# Altium project G2_LV.PrjPcb
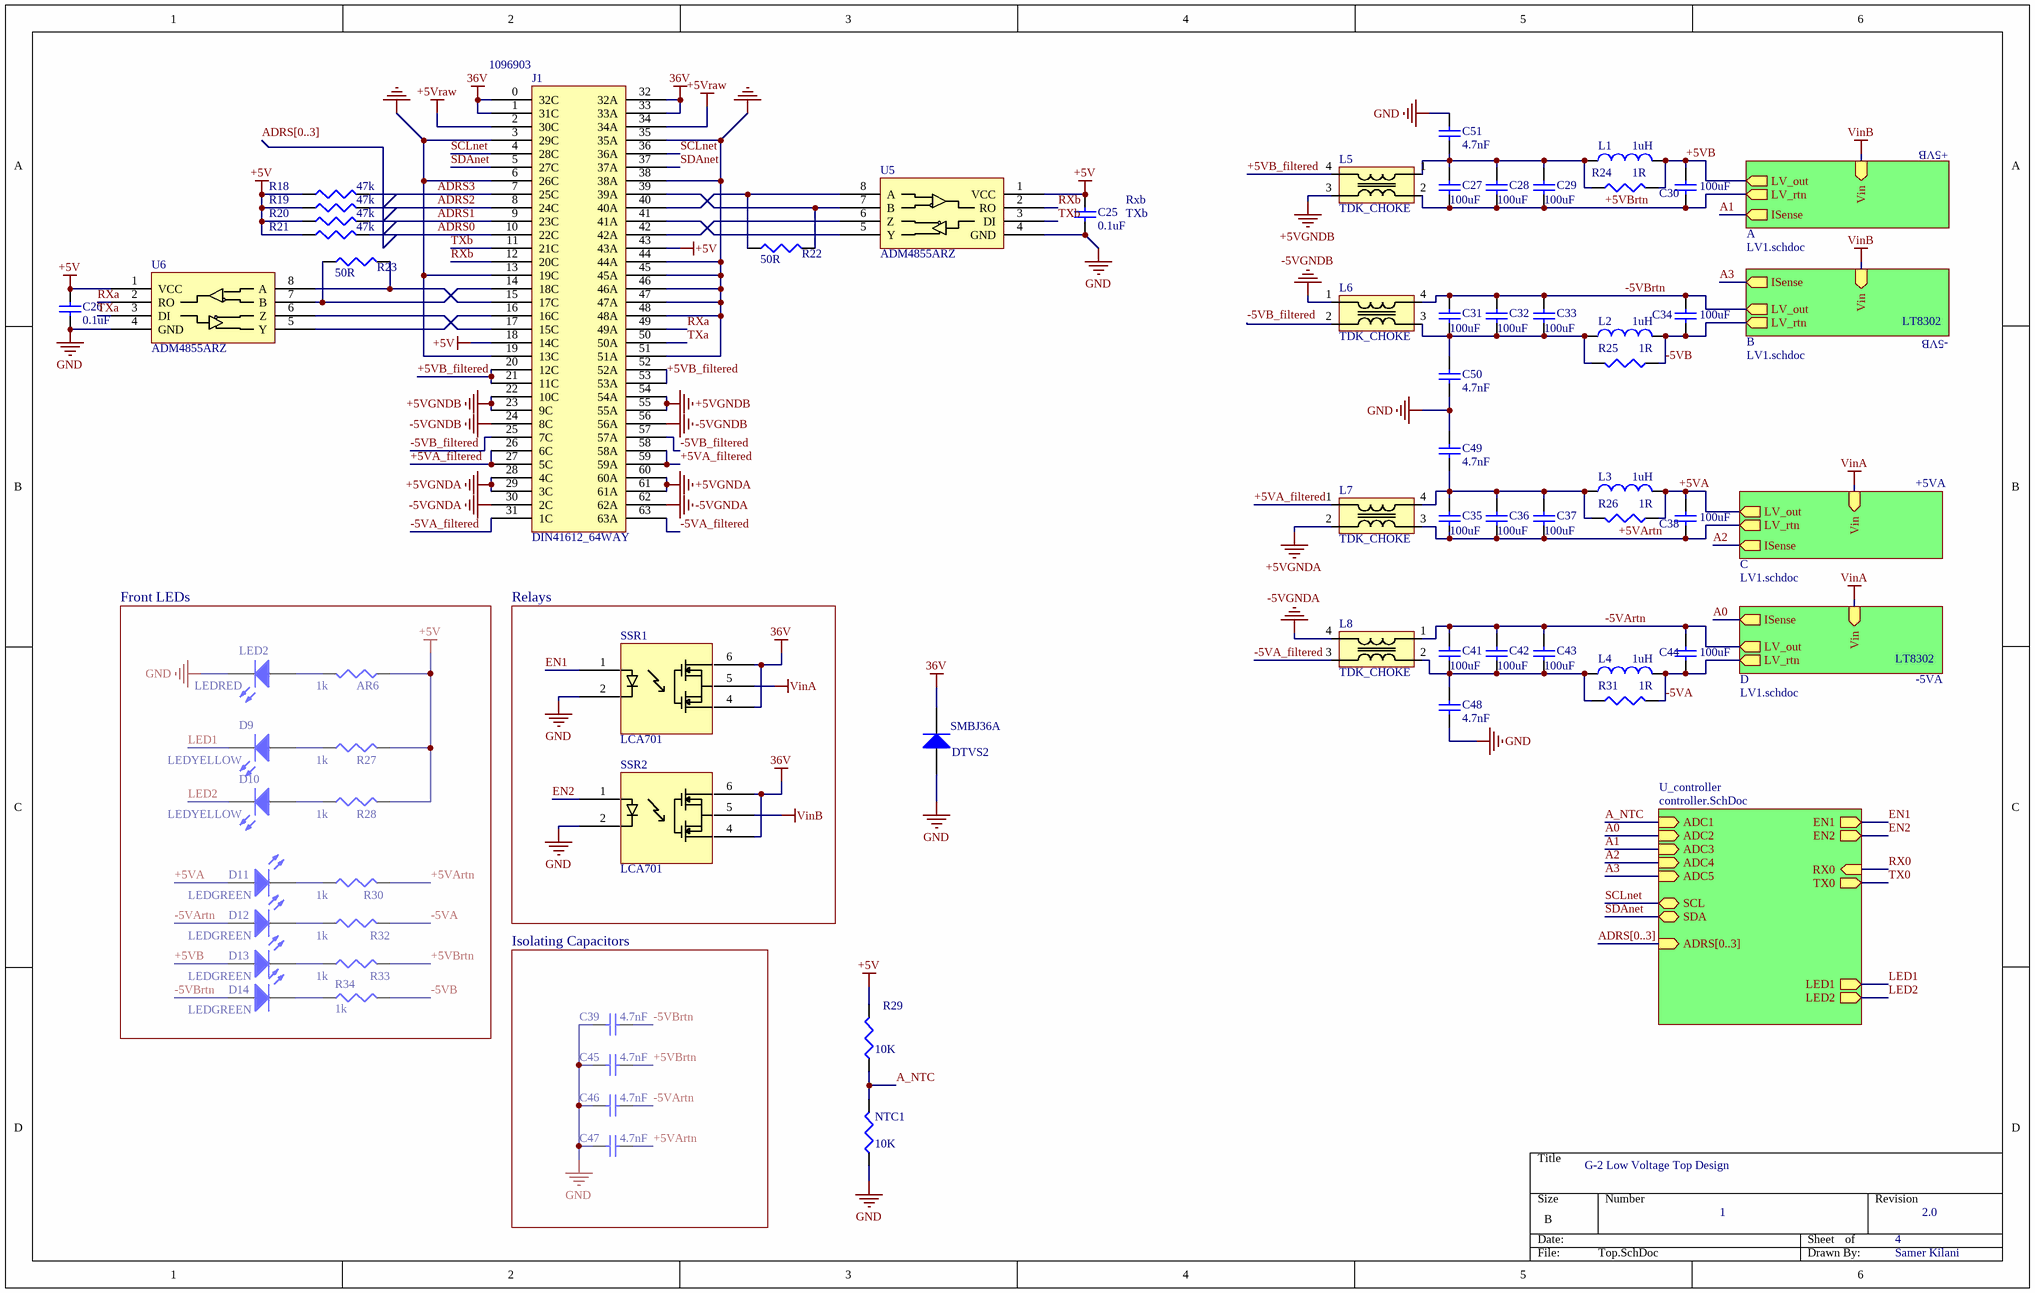
[diagram p0: Top.SchDoc]
3 sheets, 186 parts. Net scope: hierarchical (ports join the sheet entries above them; power ports are global).
Board file: LV1.PCBDOC
Sheets:
  Top.SchDoc
    B = LV1.schdoc
    D = LV1.schdoc
    U_controller = controller.SchDoc
    A = LV1.schdoc
    C = LV1.schdoc

## Sheet Top.SchDoc: G-2 Low Voltage Top Design
size B; Date: 19/01/2016; Author: Samer Kilani; DrawnBy: Samer Kilani; Engineer: Samer Kilani; Organization: UCL; DocumentNumber: 1; Revision: 2.0; SheetNumber: 1; SheetTotal: 4

### Parts
AR6  value 1k  [J1-0603]
C25  value 0.1uF  [1608[0603]]  (hidden comment: Cap Semi)
C26  value 0.1uF  [1608[0603]]  (hidden comment: Cap Semi)
C27  value 100uF  [C1210]  (hidden comment: Cap Semi)
C28  value 100uF  [C1210]  (hidden comment: Cap Semi)
C29  value 100uF  [C1210]  (hidden comment: Cap Semi)
C30  value 100uF  [C1210]  (hidden comment: Cap Semi)
C31  value 100uF  [C1210]  (hidden comment: Cap Semi)
C32  value 100uF  [C1210]  (hidden comment: Cap Semi)
C33  value 100uF  [C1210]  (hidden comment: Cap Semi)
C34  value 100uF  [C1210]  (hidden comment: Cap Semi)
C35  value 100uF  [C1210]  (hidden comment: Cap Semi)
C36  value 100uF  [C1210]  (hidden comment: Cap Semi)
C37  value 100uF  [C1210]  (hidden comment: Cap Semi)
C38  value 100uF  [C1210]  (hidden comment: Cap Semi)
C39  value 4.7nF  [1812]  (hidden comment: Cap Semi)
C41  value 100uF  [C1210]  (hidden comment: Cap Semi)
C42  value 100uF  [C1210]  (hidden comment: Cap Semi)
C43  value 100uF  [C1210]  (hidden comment: Cap Semi)
C44  value 100uF  [C1210]  (hidden comment: Cap Semi)
C45  value 4.7nF  [1812]  (hidden comment: Cap Semi)
C46  value 4.7nF  [1812]  (hidden comment: Cap Semi)
C47  value 4.7nF  [1812]  (hidden comment: Cap Semi)
C48  value 4.7nF  [1812]  (hidden comment: Cap Semi)
C49  value 4.7nF  [1812]  (hidden comment: Cap Semi)
C50  value 4.7nF  [1812]  (hidden comment: Cap Semi)
C51  value 4.7nF  [1812]  (hidden comment: Cap Semi)
D9  LEDYELLOW  [LEDYELLOW]
D10  LEDYELLOW  [LEDYELLOW]
D11  LEDGREEN  [LEDGREEN]
D12  LEDGREEN  [LEDGREEN]
D13  LEDGREEN  [LEDGREEN]
D14  LEDGREEN  [LEDGREEN]
DTVS2  PartNo: SMBJ36A  [SMBJ]  (hidden comment: SMBJ48A)
J1  DIN41612_64WAY  Supplier Part Number 1: 1096903  [09 03 164 6919]
L1  value 1uH  [MPLC0730]  (hidden comment: Inductor)
L2  value 1uH  [MPLC0730]  (hidden comment: Inductor)
L3  value 1uH  [MPLC0730]  (hidden comment: Inductor)
L4  value 1uH  [MPLC0730]  (hidden comment: Inductor)
L5  TDK_CHOKE  [ACMV_TDK]
L6  TDK_CHOKE  [ACMV_TDK]
L7  TDK_CHOKE  [ACMV_TDK]
L8  TDK_CHOKE  [ACMV_TDK]
LED2  LEDRED  [LEDRED]
NTC1  value 10K  [J1-0603]
R18  value 47k  [J1-0603]  (hidden comment: Res3)
R19  value 47k  [J1-0603]  (hidden comment: Res3)
R20  value 47k  [J1-0603]  (hidden comment: Res3)
R21  value 47k  [J1-0603]  (hidden comment: Res3)
R22  value 50R  [J1-0603]
R23  value 50R  [J1-0603]
R24  value 1R  [J1-0603]  (hidden comment: Res3)
R25  value 1R  [J1-0603]  (hidden comment: Res3)
R26  value 1R  [J1-0603]  (hidden comment: Res3)
R27  value 1k  [J1-0603]  (hidden comment: Res3)
R28  value 1k  [J1-0603]  (hidden comment: Res3)
R29  value 10K  [J1-0603]
R30  value 1k  [J1-0603]  (hidden comment: Res3)
R31  value 1R  [J1-0603]  (hidden comment: Res3)
R32  value 1k  [J1-0603]  (hidden comment: Res3)
R33  value 1k  [J1-0603]  (hidden comment: Res3)
R34  value 1k  [J1-0603]  (hidden comment: Res3)
SSR1  LCA701  [LCA701S]
SSR2  LCA701  [LCA701S]
U5  ADM4855ARZ  [SOICN8]
U6  ADM4855ARZ  [SOICN8]

### Blocks framed on the sheet
Front LEDs: AR6 D9-D14 LED2 R27 R28 R30 R32-R34
Relays: SSR1 SSR2
Isolating Capacitors: C39 C45-C47

### Sub-sheets
A = LV1.schdoc: LV_out (out), LV_rtn (out), ISense (out), Vin (in)
B = LV1.schdoc: LV_out (out), LV_rtn (out), ISense (out), Vin (in)
C = LV1.schdoc: LV_out (out), LV_rtn (out), ISense (out), Vin (in)
D = LV1.schdoc: LV_out (out), LV_rtn (out), ISense (out), Vin (in)
U_controller = controller.SchDoc: EN1 (out), ADC1 (in), ADC2 (in), EN2 (out), ADC3 (in), ADC4 (in), SCL (bidir), SDA (bidir), RX0 (in), TX0 (out), ADC5 (in), LED1 (out), LED2 (out), ADRS[0..3] (in)

### Nets
36V: DTVS2.1(K) J1.0(32C) J1.1(31C) J1.32(32A) J1.33(33A) SSR1.4 SSR1.6 SSR2.4 SSR2.6
+5V: AR6.1 C25.2 C26.2 J1.18(14C) J1.43(43A) R18.1 R19.1 R20.1 R21.1 R27.2 R28.2 R29.2 U5.1(VCC) U6.1(VCC)
+5VGNDA: J1.28(4C) J1.29(3C) J1.60(60A) J1.61(61A) L7.2
+5VGNDB: J1.22(10C) J1.23(9C) J1.54(54A) J1.55(55A) L5.3
+5Vraw: J1.2(30C) J1.34(34A)
-5VGNDA: J1.30(2C) J1.62(62A) L8.4
-5VGNDB: J1.24(8C) J1.56(56A) L6.1
GND: C25.1 C26.1 C39.1 C45.1 C46.1 C47.1 C48.1 C49.2 C50.1 C51.2 DTVS2.2(A) J1.3(29C) J1.6(26C) J1.13(19C) J1.19(13C) J1.35(35A) J1.38(38A) J1.44(44A) J1.45(45A) J1.46(46A) J1.47(47A) J1.48(48A) J1.51(51A) LED2.1(K) NTC1.1 SSR1.2 SSR2.2 U5.4(GND) U6.4(GND)
VinA: SSR1.5 ; sheet D/Vin, sheet C/Vin
VinB: SSR2.5 ; sheet B/Vin, sheet A/Vin
+5VA: C38.1 D11.2(A) L3.2 R26.1 ; sheet C/LV_out
+5VA_filtered: J1.26(6C) J1.27(5C) J1.58(58A) J1.59(59A) L7.1
+5VArtn: C35.2 C36.2 C37.2 C38.2 C47.2 L7.3 R30.2 ; sheet C/LV_rtn
+5VB: C30.2 D13.2(A) L1.2 R24.2 ; sheet A/LV_out
+5VB_filtered: J1.20(12C) J1.21(11C) J1.52(52A) J1.53(53A) L5.4
+5VBrtn: C27.1 C28.1 C29.1 C30.1 C45.2 L5.2 R33.2 ; sheet A/LV_rtn
-5VA: C44.1 L4.2 R31.2 R32.2 ; sheet D/LV_rtn
-5VA_filtered: J1.31(1C) J1.63(63A) L8.3
-5VArtn: C41.2 C42.2 C43.2 C44.2 C46.2 D12.2(A) L8.1 ; sheet D/LV_out
-5VB: C34.2 L2.2 R25.1 R34.2 ; sheet B/LV_rtn
-5VB_filtered: J1.25(7C) J1.57(57A) L6.2
-5VBrtn: C31.1 C32.1 C33.1 C34.1 C39.2 D14.2(A) L6.4 ; sheet B/LV_out
A0: sheet D/ISense, sheet U_controller/ADC2
A1: sheet U_controller/ADC3, sheet A/ISense
A2: sheet U_controller/ADC4, sheet C/ISense
A3: sheet B/ISense, sheet U_controller/ADC5
A_NTC: NTC1.2 R29.1 ; sheet U_controller/ADC1
ADRS0: J1.10(22C) R21.2
ADRS1: J1.9(23C) R20.2
ADRS2: J1.8(24C) R19.2
ADRS3: J1.7(25C) R18.2
EN1: SSR1.1 ; sheet U_controller/EN1
EN2: SSR2.1 ; sheet U_controller/EN2
LED1: D9.1(K) ; sheet U_controller/LED1
LED2: D10.1(K) ; sheet U_controller/LED2
RXa: J1.49(49A) U6.2(RO)
RXb: J1.12(20C) U5.2(RO)
SCLnet: J1.4(28C) J1.36(36A) ; sheet U_controller/SCL  [project net SCL]
SDAnet: J1.5(27C) J1.37(37A) ; sheet U_controller/SDA  [project net SDA]
TXa: J1.50(50A) U6.3(DI)
TXb: J1.11(21C) U5.3(DI)
NetAR6_2: AR6.2 LED2.2(A)
NetC27_2: C27.2 C28.2 C29.2 C51.1 L1.1 L5.1 R24.1
NetC31_2: C31.2 C32.2 C33.2 C50.2 L2.1 L6.3 R25.2
NetC35_1: C35.1 C36.1 C37.1 C49.1 L3.1 L7.4 R26.2
NetC41_1: C41.1 C42.1 C43.1 C48.2 L4.1 L8.2 R31.1
NetD9_2: D9.2(A) R27.1
NetD10_2: D10.2(A) R28.1
NetD11_1: D11.1(K) R30.1
NetD12_1: D12.1(K) R32.1
NetD13_1: D13.1(K) R33.1
NetD14_1: D14.1(K) R34.1
NetJ1_14: J1.14(18C) R23.1 U6.7(B)
NetJ1_15: J1.15(17C) R23.2 U6.8(A)
NetJ1_16: J1.16(16C) U6.5(Y)
NetJ1_17: J1.17(15C) U6.6(Z)
NetJ1_39: J1.39(39A) R22.2 U5.7(B)
NetJ1_40: J1.40(40A) R22.1 U5.8(A)
NetJ1_41: J1.41(41A) U5.5(Y)
NetJ1_42: J1.42(42A) U5.6(Z)

### Buses and harness runs
bus ADRS[0..3]
bus ADRS[0..3] = sheet U_controller/ADRS[0..3]

### Notes on the sheet
- +5VB
- (near C25) Rxb
- (near C25) TXb
- LT3748
- LT8302
- -5VB
- +5VA
- -5VA

### Library data of the parts
AR6 R18-R34 = Res3: Resistor; Published: 8-Jun-2000; LatestRevisionDate: 29-May-2009; LatestRevisionNote: IPC-7351 Footprint Added.; PackageReference: J1-0603; Publisher: Altium Limited; PackageDescription: Chip Resistor
C25 C26 = Cap Semi: Capacitor (Semiconductor SIM Model); PartNo: CC0603KRX7R9BB104; Published: 8-Jun-2000; LatestRevisionDate: 29-May-2009; LatestRevisionNote: IPC-7351 Footprint Added.; PackageReference: C1206; Publisher: Altium Limited; PackageDescription: Chip Capacitor
C27-C29 C31-C33 C35-C37 C41-C43 = Cap Semi: Capacitor (Semiconductor SIM Model); PartNo: CL32A107MPVNNNE; Published: 8-Jun-2000; LatestRevisionDate: 29-May-2009; LatestRevisionNote: IPC-7351 Footprint Added.; PackageReference: C1206; Publisher: Altium Limited; PackageDescription: Chip Capacitor
C30 C34 C38 C44 = Cap Semi: Capacitor (Semiconductor SIM Model); PartNo: C3225X5R0J107M250AC; Published: 8-Jun-2000; LatestRevisionDate: 29-May-2009; LatestRevisionNote: IPC-7351 Footprint Added.; PackageReference: C1206; Publisher: Altium Limited; PackageDescription: Chip Capacitor
C39 C45-C51 = Cap Semi: Capacitor (Semiconductor SIM Model); PartNo: C1812C472KDRACTU; Published: 8-Jun-2000; LatestRevisionDate: 29-May-2009; LatestRevisionNote: IPC-7351 Footprint Added.; PackageReference: C1206; Publisher: Altium Limited; PackageDescription: Chip Capacitor
D9 D10 = LEDYELLOW: PartNo: 550-0307F
D11-D14 = LEDGREEN: PartNo: 550-0207F
  D11: Supplier 1: RS-Components; Supplier Part Number 1: 890-6921
DTVS2 = SMBJ: TVS; Note: Pin 2 is not connected and not drawn.; Published: 21-Mar-2003; LatestRevisionDate: 29-May-2009; LatestRevisionNote: IPC-7351 Footprint Added.; DatasheetVersion: Oct-1999; PackageVersion: Sep-2001; PackageReference: SOT-23; Publisher: Altium Limited; PackageDescription: 3-Pin SOT-23 Package 0.95 mm Pitch, 2.5 mm Lead Span; ComponentLink1Description: Manufacturer Link; ComponentLink1URL: http://www.infineon.com/; ComponentLink2Description: Datasheet; ComponentLink2URL: http://www.infineon.com/upload/Document/cmc_upload/documents/080/656/bas116series.pdf
J1 = DIN41612_64WAY: PartNo: 0903 164 6921; Supplier 1: Farnell
L1-L4 = Inductor: PartNo: MPLC0730L1R0; Code_IEC: 1005; Published: 8-Jun-2000; LatestRevisionDate: 29-May-2009; LatestRevisionNote: IPC-7351 Footprint Added.; PackageReference: 0402-A; Publisher: Altium Limited; PackageDescription: Chip Inductor; Code_JEITA: 0402
L5-L8 = TDK_CHOKE: PartNo: ACM90V-701-2PL
LED2 = LEDRED: PartNo: 550-0407F
NTC1 = Res3: Resistor; PartNo: NCP18XH103J03RB; Published: 8-Jun-2000; LatestRevisionDate: 29-May-2009; LatestRevisionNote: IPC-7351 Footprint Added.; PackageReference: J1-0603; Publisher: Altium Limited; PackageDescription: Chip Resistor
U5 U6 = SP3084EEN-L: PartNo: ADM4855ARZ
SSR1 SSR2 = LCA701: PartNo: LCA701S

## Sheet LV1.schdoc: 36V to 5V Isolated supply
size A4; Organization: UCL; Address1: Address1; Address2: Address2; Address3: Address3; Address4: Address4; DocumentNumber: 3; Revision: 2.0; SheetNumber: 3; SheetTotal: 3; Author: Samer Kilani; DrawnBy: Samer Kilani; Engineer: Samer Kilani
Used 4 times, as channels B, D, A, C. Parts and nets are listed once, with the designators drawn on the sheet.
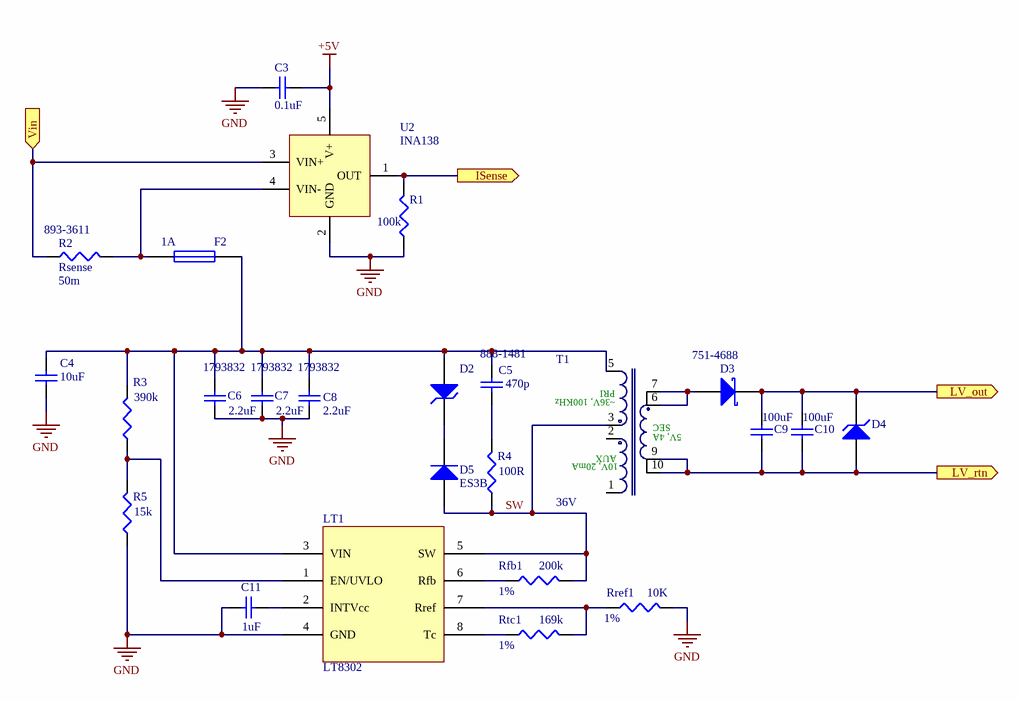
[diagram p1: LV1.schdoc]

### Parts
C3  value 0.1uF  [1608[0603]]  (hidden comment: Cap Semi)
C4  value 10uF  [C1210]  (hidden comment: Cap Semi)
C5  value 470p  Supplier Part Number 1: 888-1481  [C0805]  (hidden comment: Cap Semi)
C6  value 2.2uF  Supplier Part Number 1: 1793832  [C1210]  (hidden comment: Cap Semi)
C7  value 2.2uF  Supplier Part Number 1: 1793832  [C1210]  (hidden comment: Cap Semi)
C8  value 2.2uF  Supplier Part Number 1: 1793832  [C1210]  (hidden comment: Cap Semi)
C9  value 100uF  [C1210]  (hidden comment: Cap Semi)
C10  value 100uF  [C1210]  (hidden comment: Cap Semi)
C11  value 1uF  [1608[0603]]  (hidden comment: Cap Semi)
D2  SMAJ30A  [DO-214AC]  (value not drawn)
D3  Supplier Part Number 1: 751-4688  [PDS1040L]  (hidden comment: PDS1040L)
D4  BZT52H-B5V6  [SOD123F]  (value not drawn)
D5  ES3B  [DO-214AB]
F2  Tripping current: 1A  [MC33192]
LT1  LT8302  [S8E]
R1  value 100k  [J1-0603]  (hidden comment: Res3)
R2  Rsense  value 50m  Supplier Part Number 1: 893-3611  [R6432]
R3  value 390k  [J1-0603]  (hidden comment: Res3)
R4  value 100R  [C1206]  (hidden comment: Res3)
R5  value 15k  [J1-0603]  (hidden comment: Res3)
Rfb1  value 200k  Tolerance: 1%  [J1-0603]  (hidden comment: Res3)
Rref1  value 10K  Tolerance: 1%  [J1-0603]  (hidden comment: Res3)
Rtc1  value 169k  Tolerance: 1%  [J1-0603]  (hidden comment: Res3)
T1  36V  [EP13]
U2  INA138  [SOT-23]

### Ports
ISense (out), LV_out (out), LV_rtn (out), Vin (in)

### Nets
+5V: C3.2 U2.5(V+)
GND: C3.1 C4.1 C6.1 C7.1 C8.1 C11.2 LT1.4(GND) R1.1 R5.1 Rref1.2 U2.2(GND)
ISense: R1.2 U2.1(OUT) ; port ISense
LV_out: C9.2 C10.2 D3.2(K) D4.2(K) ; port LV_out
LV_rtn: C9.1 C10.1 D4.1(A) T1.9 T1.10 ; port LV_rtn
SW: D5.2(A) LT1.5(SW) R4.1 Rfb1.2 T1.3
Vin: R2.1 U2.3(VIN+) ; port Vin
NetC4_2: C4.2 C5.2 C6.2 C7.2 C8.2 D2.1(A) F2.2 LT1.3(VIN) R3.2 T1.5
NetC5_1: C5.1 R4.2
NetC11_1: C11.1 LT1.2(INTVcc)
NetD2_2: D2.2(K) D5.1(K)
NetD3_1: D3.1(A) T1.6 T1.7
NetF2_1: F2.1 R2.2 U2.4(VIN-)
NetLT1_1: LT1.1(EN/UVLO) R3.1 R5.2
NetLT1_6: LT1.6(Rfb) Rfb1.1
NetLT1_7: LT1.7(Rref) Rref1.1 Rtc1.2
NetLT1_8: LT1.8(Tc) Rtc1.1

Not connected (* = marked no-connect by the designer): T1 1 2

### Channels
B: designators end in _B; ports ISense=A3 LV_out=-5VBrtn LV_rtn=-5VB Vin=VinB
D: designators end in _D; ports ISense=A0 LV_out=-5VArtn LV_rtn=-5VA Vin=VinA
A: designators end in _A; ports ISense=A1 LV_out=+5VB LV_rtn=+5VBrtn Vin=VinB
C: designators end in _C; ports ISense=A2 LV_out=+5VA LV_rtn=+5VArtn Vin=VinA

### Notes on the sheet
- (in symbol WE-FB, 750311457) PRI; ~36V, 100KHz; SEC; 5V, 4A; AUX; 10V, 20mA

### Library data of the parts
C3 = Cap Semi: as C25 on sheet Top; Published: 8-Jun-2000; LatestRevisionDate: 29-May-2009; LatestRevisionNote: IPC-7351 Footprint Added.; PackageReference: C1206; Publisher: Altium Limited; PackageDescription: Chip Capacitor
C4 = Cap Semi: Capacitor (Semiconductor SIM Model); PartNo: GRM32ER61H106KA12L; Published: 8-Jun-2000; LatestRevisionDate: 29-May-2009; LatestRevisionNote: IPC-7351 Footprint Added.; PackageReference: C1206; Publisher: Altium Limited; PackageDescription: Chip Capacitor
C5 = Cap Semi: Capacitor (Semiconductor SIM Model); PartNo: 08055A221JAT2A; Published: 8-Jun-2000; LatestRevisionDate: 29-May-2009; LatestRevisionNote: IPC-7351 Footprint Added.; PackageReference: C1206; Publisher: Altium Limited; PackageDescription: Chip Capacitor; Supplier 1: RS-Components
C6-C8 = Cap Semi: Capacitor (Semiconductor SIM Model); PartNo: C1210C225K1RACTU; Published: 8-Jun-2000; LatestRevisionDate: 29-May-2009; LatestRevisionNote: IPC-7351 Footprint Added.; PackageReference: C1206; Publisher: Altium Limited; PackageDescription: Chip Capacitor; Supplier 1: Farnell
C9 C10 = Cap Semi: as C30 on sheet Top; Published: 8-Jun-2000; LatestRevisionDate: 29-May-2009; LatestRevisionNote: IPC-7351 Footprint Added.; PackageReference: C1206; Publisher: Altium Limited; PackageDescription: Chip Capacitor
C11 = Cap Semi: Capacitor (Semiconductor SIM Model); PartNo: 06033D105KAT2A; Published: 8-Jun-2000; LatestRevisionDate: 29-May-2009; LatestRevisionNote: IPC-7351 Footprint Added.; PackageReference: C1206; Publisher: Altium Limited; PackageDescription: Chip Capacitor
D2 = D Zener: Zener Diode; Published: 8-Jun-2000; LatestRevisionDate: 17-Jul-2002; LatestRevisionNote: Re-released for DXP Platform.; PackageReference: DIODE-0.7; Publisher: Altium Limited; PackageDescription: Diode, Thru-Hole; 2 Leads; 0.7 in Pin Spacing; PartNo: SMAJ30A
D3 = PDS1040L: Schottky Diode; PartNo: SBR15U50SP5-13; Published: 8-Jun-2000; LatestRevisionDate: 17-Jul-2002; LatestRevisionNote: Re-released for DXP Platform.; PackageReference: SMC; Publisher: Altium Limited; Code_JEDEC: DO-214-AA; Supplier 1: RS-Components
D4 = BZT52H-B5V6: Zener Diode; pin to pad: 1>2 2>1; Published: 8-Jun-2000; LatestRevisionDate: 17-Jul-2002; LatestRevisionNote: Re-released for DXP Platform.; PackageReference: DIODE-0.7; Publisher: Altium Limited; PackageDescription: Diode, Thru-Hole; 2 Leads; 0.7 in Pin Spacing; PartNo: BZT52H-B5V6
D5 = ES3B: Power Diode; Note: Pin 2 is not connected and not drawn.; Published: 21-Mar-2003; LatestRevisionDate: 29-May-2009; LatestRevisionNote: IPC-7351 Footprint Added.; DatasheetVersion: Oct-1999; PackageVersion: Sep-2001; PackageReference: SOT-23; Publisher: Altium Limited; PackageDescription: 3-Pin SOT-23 Package 0.95 mm Pitch, 2.5 mm Lead Span; ComponentLink1Description: Manufacturer Link; ComponentLink1URL: http://www.infineon.com/; ComponentLink2Description: Datasheet; ComponentLink2URL: http://www.infineon.com/upload/Document/cmc_upload/documents/080/656/bas116series.pdf; PartNo: ES3B
F2 = Fuse 1: Fuse; Published: 8-Jun-2000; LatestRevisionDate: 17-Jul-2002; LatestRevisionNote: Re-released for DXP Platform.; PackageReference: PIN-W2/E2.8; Publisher: Altium Limited; PackageDescription: Thru-Hole; 2 Leads; PartNo: MC33192
LT1 = LT8302: PartNo: LT8302ES8E#PBF
R1 R3 R5 Rfb1 Rref1 Rtc1 = Res3: Resistor; Published: 8-Jun-2000; LatestRevisionDate: 29-May-2009; LatestRevisionNote: IPC-7351 Footprint Added.; PackageReference: J1-0603; Publisher: Altium Limited; PackageDescription: Chip Resistor
R2 = Rsense: CRF2512-FV-R001ELF; PartNo: MCS3264R050FER; Published: 8-Jun-2000; LatestRevisionDate: 29-May-2009; LatestRevisionNote: IPC-7351 Footprint Added.; PackageReference: J1-0603; Publisher: Altium Limited; PackageDescription: Chip Resistor; Supplier 1: RS-Components
R4 = Res3: Resistor; PartNo: CRS1206-FX-1000ELF; Published: 8-Jun-2000; LatestRevisionDate: 29-May-2009; LatestRevisionNote: IPC-7351 Footprint Added.; PackageReference: J1-1206; Publisher: Altium Limited; PackageDescription: Chip Resistor
T1 = WE-FB, 750311457: Flyback Transformer suitable or LT3573/ LT3574/ LT3575/ LT3748 WE-FB, Ui=36V; Manufacturer: Würth Elektronik eiSos GmbH; PartNo: 750311457; Ui: 36V; ComponentLink1Description: Manufacturer; ComponentLink1URL: http://www.we-online.de; Created by: Otto Christin; Created Date: OCT 2013; ComponentLink2Description: Datasheet; ComponentLink2URL: http://katalog.we-online.de/pbs/datasheet/750311457.pdf
U2 = INA138: PartNo: INA138NA/250

## Sheet controller.SchDoc: LV Microcontroller
size A4; Author: Samer Kilani; CompanyName: UCL; DrawnBy: Samer Kilani; Engineer: Samer Kilani; DocumentNumber: 2; Revision: 2.0; SheetNumber: 2; SheetTotal: 3
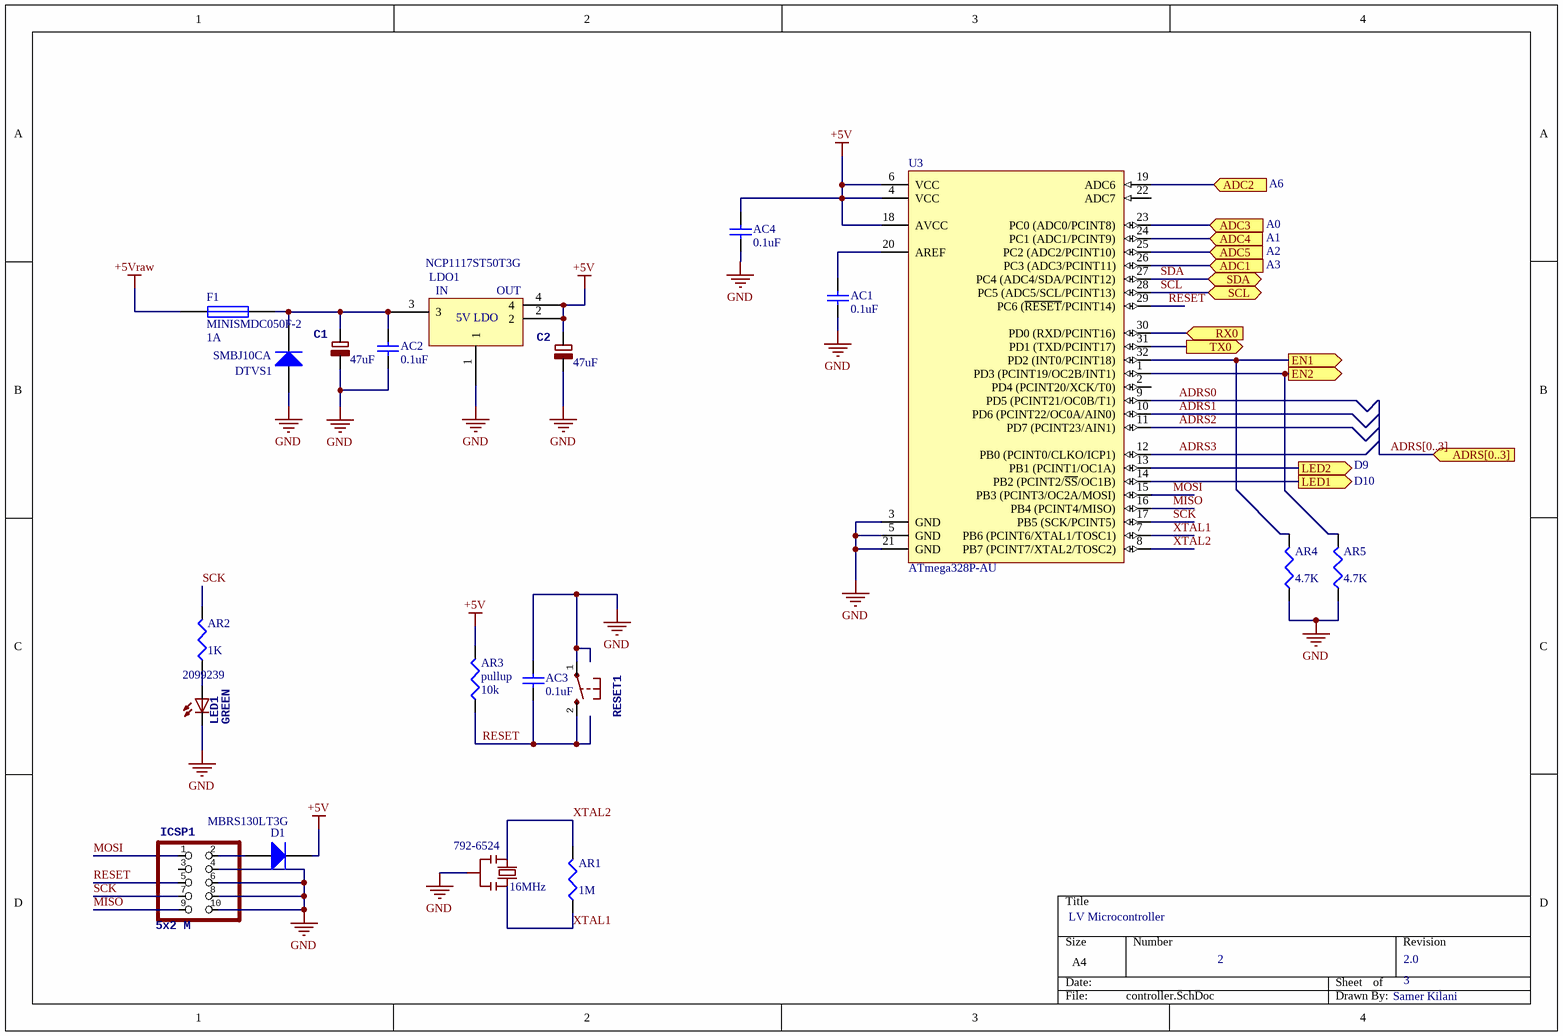
[diagram p2: controller.SchDoc]

### Parts
AC1  value 0.1uF  [1608[0603]]  (hidden comment: Cap Semi)
AC2  value 0.1uF  [1608[0603]]  (hidden comment: Cap Semi)
AC3  value 0.1uF  [1608[0603]]  (hidden comment: Cap Semi)
AC4  value 0.1uF  [1608[0603]]  (hidden comment: Cap Semi)
AR1  value 1M  [J1-0603]
AR2  value 1K  [J1-0603]
AR3  pullup  value 10k  [J1-0603]
AR4  value 4.7K  [J1-0603]
AR5  value 4.7K  [J1-0603]
C1  value 47uF  [PANASONIC_D]
C2  value 47uF  [PANASONIC_D]
D1  MBRS130LT3G  [SMB-403A]
DTVS1  SMBJ10CA  [DO-214AA]
F1  MINISMDC050F-2  Tripping current: 1A  [MF-MSMF1]
ICSP1  5x2 M  [2X05]
LDO1  PartNo: NCP1117ST50T3G  [SOT223]  (hidden comment: LDO_5V)
LED1  GREEN  Supplier Part Number 1: 2099239  [CHIP-LED0805]
RESET1  PB_RST  [1-1825027-4]  (value not drawn)
U3  ATmega328P-AU  [32A_N]
Y1  Supplier Part Number 1: 792-6524  [RESONATOR]

### Ports
ADC1 (in), ADC2 (in), ADC3 (in), ADC4 (in), ADC5 (in), ADRS[0..3] (in), EN1 (out), EN2 (out), LED1 (out), LED2 (out), RX0 (in), SCL (bidir), SDA (bidir), TX0 (out)

### Nets
+5V: AC4.2 AR3.2 C2.1 D1.1(K) LDO1.2 LDO1.4 U3.4(VCC) U3.6(VCC) U3.18(AVCC)
+5Vraw: F1.1
GND: AC1.1 AC2.1 AC3.2 AC4.1 AR4.1 AR5.1 C1.2 C2.2 DTVS1.2(A) ICSP1.4 ICSP1.6 ICSP1.8 ICSP1.10 LDO1.1 LED1.C RESET1.1 U3.3(GND) U3.5(GND) U3.21(GND) Y1.2
A0: U3.19(ADC6) ; port ADC2
A1: U3.23(PC0_(ADC0/PCINT8)) ; port ADC3
A2: U3.24(PC1_(ADC1/PCINT9)) ; port ADC4
A3: U3.25(PC2_(ADC2/PCINT10)) ; port ADC5
A_NTC: U3.26(PC3_(ADC3/PCINT11)) ; port ADC1
ADRS0: U3.9(PD5_(PCINT21/OC0B/T1))
ADRS1: U3.10(PD6_(PCINT22/OC0A/AIN0))
ADRS2: U3.11(PD7_(PCINT23/AIN1))
ADRS3: U3.12(PB0_(PCINT0/CLKO/ICP1))
EN1: AR4.2 U3.32(PD2_(INT0/PCINT18)) ; port EN1
EN2: AR5.2 U3.1(PD3_(PCINT19/OC2B/INT1)) ; port EN2
LED1: U3.14(PB2_(PCINT2/~{SS}/OC1B)) ; port LED1
LED2: U3.13(PB1_(PCINT1/OC1A)) ; port LED2
MISO: ICSP1.9 U3.16(PB4_(PCINT4/MISO))
MOSI: ICSP1.1 U3.15(PB3_(PCINT3/OC2A/MOSI))
RESET: AC3.1 AR3.1 ICSP1.5 RESET1.2 U3.29(PC6_(~{RESET}/PCINT14))
RX0: U3.30(PD0_(RXD/PCINT16)) ; port RX0
SCK: AR2.2 ICSP1.7 U3.17(PB5_(SCK/PCINT5))
SCL: U3.28(PC5_(ADC5/SCL/PCINT13)) ; port SCL
SDA: U3.27(PC4_(ADC4/SDA/PCINT12)) ; port SDA
TX0: U3.31(PD1_(TXD/PCINT17)) ; port TX0
XTAL1: AR1.1 U3.7(PB6_(PCINT6/XTAL1/TOSC1)) Y1.3
XTAL2: AR1.2 U3.8(PB7_(PCINT7/XTAL2/TOSC2)) Y1.1
NetAC1_2: AC1.2 U3.20(AREF)
NetAC2_2: AC2.2 C1.1 DTVS1.1(K) F1.2 LDO1.3
NetAR2_1: AR2.1 LED1.A
NetD1_2: D1.2(A) ICSP1.2

Not connected (* = marked no-connect by the designer): ICSP1 3; U3 2(PD4_(PCINT20/XCK/T0)) 22(ADC7)

### Buses and harness runs
bus ADRS[0..3] = port ADRS[0..3]

### Notes on the sheet
- A0
- A1
- A6
- A2
- A3
- D9
- D10
- (near Y1) 16MHz
- (in symbol LDO_5V) IN; OUT; 5V LDO

### Library data of the parts
AC1-AC4 = Cap Semi: as C25 on sheet Top; Published: 8-Jun-2000; LatestRevisionDate: 29-May-2009; LatestRevisionNote: IPC-7351 Footprint Added.; PackageReference: C1206; Publisher: Altium Limited; PackageDescription: Chip Capacitor
AR1-AR5 = Res3: Resistor; Published: 8-Jun-2000; LatestRevisionDate: 29-May-2009; LatestRevisionNote: IPC-7351 Footprint Added.; PackageReference: J1-0603; Publisher: Altium Limited; PackageDescription: Chip Resistor
C1 C2 = CPOL-EUD: PartNo: EEE1EA470WAP
D1 = MBRS130LT3G: Power Diode; Note: Pin 2 is not connected and not drawn.; Published: 21-Mar-2003; LatestRevisionDate: 29-May-2009; LatestRevisionNote: IPC-7351 Footprint Added.; DatasheetVersion: Oct-1999; PackageVersion: Sep-2001; PackageReference: SOT-23; Publisher: Altium Limited; PackageDescription: 3-Pin SOT-23 Package 0.95 mm Pitch, 2.5 mm Lead Span; ComponentLink1Description: Manufacturer Link; ComponentLink1URL: http://www.infineon.com/; ComponentLink2Description: Datasheet; ComponentLink2URL: http://www.infineon.com/upload/Document/cmc_upload/documents/080/656/bas116series.pdf; PartNo: MBRS130LT3G
DTVS1 = SMBJ: as DTVS2 on sheet Top; Published: 21-Mar-2003; LatestRevisionDate: 29-May-2009; LatestRevisionNote: IPC-7351 Footprint Added.; DatasheetVersion: Oct-1999; PackageVersion: Sep-2001; PackageReference: SOT-23; Publisher: Altium Limited; PackageDescription: 3-Pin SOT-23 Package 0.95 mm Pitch, 2.5 mm Lead Span; ComponentLink1Description: Manufacturer Link; ComponentLink1URL: http://www.infineon.com/; ComponentLink2Description: Datasheet; ComponentLink2URL: http://www.infineon.com/upload/Document/cmc_upload/documents/080/656/bas116series.pdf; PartNo: SMBJ10CA
F1 = Fuse 1: Fuse; Published: 8-Jun-2000; LatestRevisionDate: 17-Jul-2002; LatestRevisionNote: Re-released for DXP Platform.; PackageReference: PIN-W2/E2.8; Publisher: Altium Limited; PackageDescription: Thru-Hole; 2 Leads; PartNo: MINISMDC050F-2
ICSP1 = PINHD-2X5: PartNo: 2-1761605-3
LED1 = LEDCHIP-LED0805: PartNo: KPT-2012SGC; Supplier 1: Farnell
U3 = ATmega328P-AU: 8-bit AVR Microcontroller, 32KB Flash, 1KB EEPROM, 2KB SRAM, 32-pin TQFP, Industrial Grade (-40°C to 85°C); DatasheetVersion: revD, May-2011; PackageVersion: revC, Oct-2010; PackageReference: 32A; PackageDescription: 32-Lead, 7x7x1.0 mm Body, 0.8mm Lead Pitch, Thin Profile Plastic Quad Flat Package (TQFP); Code_JEDEC: MS-026-ABA; ComponentLink1Description: Manufacturer URL; ComponentLink1URL: http://www.atmel.com/; ComponentLink2Description: ATmega48A/48PA/88A/88PA/168A/168PA/328/328P Datasheet; ComponentLink2URL: http://www.atmel.com/dyn/resources/prod_documents/doc8271.pdf; ComponentLink3Description: ATmega48A/48PA/88A/88PA/168A/168PA/328/328P Summary; ComponentLink3URL: http://www.atmel.com/dyn/resources/prod_documents/8271S.pdf; PartNo: ATmega328P-AU
Y1 = RESONATORMU: PartNo: CSTCE16M0V53-R0; Supplier 1: RS-Components
RESET1 = PB_RST: PartNo: 1-1825027-4

## Nets that join several sheets
+5V: Top (14 pins), B (C3_B.2 U2_B.5), D (C3_D.2 U2_D.5), controller (9 pins), A (C3_A.2 U2_A.5), C (C3_C.2 U2_C.5)
+5Vraw: Top (J1.2 J1.34), controller (F1.1)
GND: Top (29 pins), B (11 pins), D (11 pins), controller (20 pins), A (11 pins), C (11 pins)
VinA: Top (SSR1.5), D (R2_D.1 U2_D.3), C (R2_C.1 U2_C.3)
VinB: Top (SSR2.5), B (R2_B.1 U2_B.3), A (R2_A.1 U2_A.3)
+5VA: Top (C38.1 D11.2 L3.2 R26.1), C (C9_C.2 C10_C.2 D3_C.2 D4_C.2)
+5VArtn: Top (7 pins), C (5 pins)
+5VB: Top (C30.2 D13.2 L1.2 R24.2), A (C9_A.2 C10_A.2 D3_A.2 D4_A.2)
+5VBrtn: Top (7 pins), A (5 pins)
-5VA: Top (C44.1 L4.2 R31.2 R32.2), D (5 pins)
-5VArtn: Top (7 pins), D (C9_D.2 C10_D.2 D3_D.2 D4_D.2)
-5VB: Top (C34.2 L2.2 R25.1 R34.2), B (5 pins)
-5VBrtn: Top (7 pins), B (C9_B.2 C10_B.2 D3_B.2 D4_B.2)
A0: D (R1_D.2 U2_D.1), controller (U3.19)
A1: controller (U3.23), A (R1_A.2 U2_A.1)
A2: controller (U3.24), C (R1_C.2 U2_C.1)
A3: B (R1_B.2 U2_B.1), controller (U3.25)
A_NTC: Top (NTC1.2 R29.1), controller (U3.26)
ADRS0: Top (J1.10 R21.2), controller (U3.9)
ADRS1: Top (J1.9 R20.2), controller (U3.10)
ADRS2: Top (J1.8 R19.2), controller (U3.11)
ADRS3: Top (J1.7 R18.2), controller (U3.12)
EN1: Top (SSR1.1), controller (AR4.2 U3.32)
EN2: Top (SSR2.1), controller (AR5.2 U3.1)
LED1: Top (D9.1), controller (U3.14)
LED2: Top (D10.1), controller (U3.13)
SCL: Top (J1.4 J1.36), controller (U3.28)
SDA: Top (J1.5 J1.37), controller (U3.27)